# Altium schematic sheet Control.SchDoc
size A4
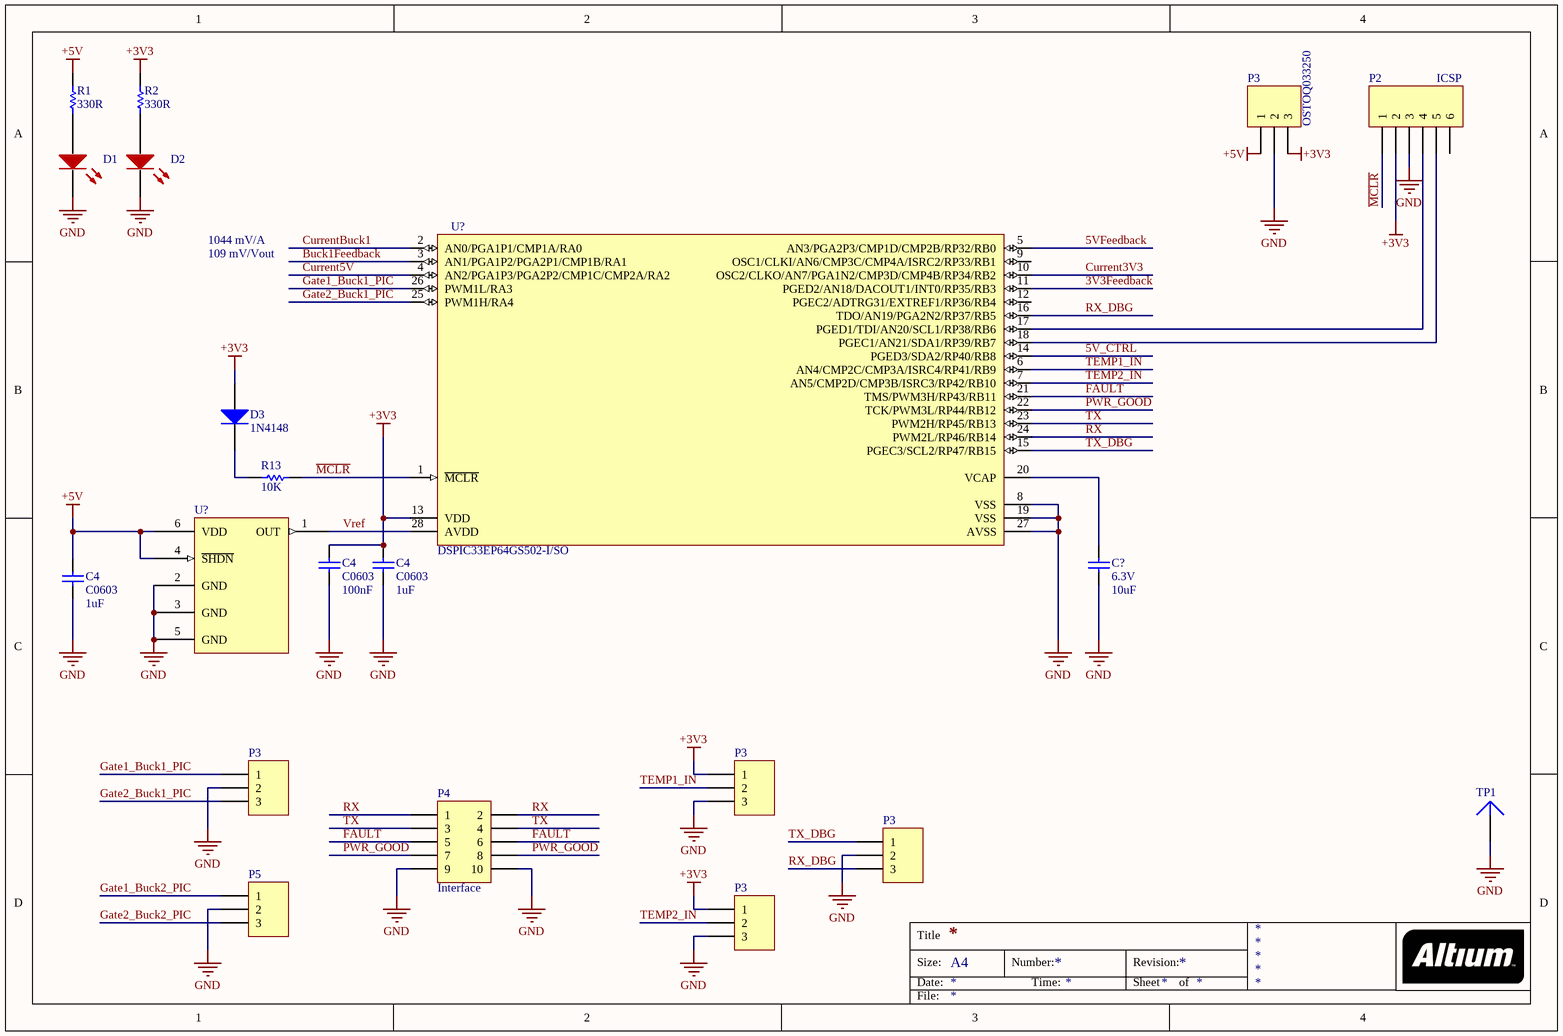
[diagram p0: Control.SchDoc]

## Parts
(Parts that share a designator on the sheet are numbered #1, #2 ... from top to bottom, then left to right.)
C4#1  C0603  value 100nF  [0603]
C4#2  C0603  value 1uF  [0603]
C4#3  C0603  value 1uF  [0603]
C?  6.3V  value 10uF  [C0805]
D1  15-21SURC/S530-A3/TR8  [15-21SURC/S530-A3/TR8]  (value not drawn)
D2  15-21SURC/S530-A3/TR8  [15-21SURC/S530-A3/TR8]  (value not drawn)
D3  1N4148  [SOD80C]
P2  ICSP  [My_1X06]
P3#1  XY2500R-F 3P  [OSTOQ033250]  (value not drawn)
P3#2  Header 3  [My_1X03]  (value not drawn)
P3#3  Header 3  [My_1X03]  (value not drawn)
P3#4  Header 3  [My_1X03]  (value not drawn)
P3#5  Header 3  [My_1X03]  (value not drawn)
P4  Interface  [HDR2X5]
P5  Header 3  [My_1X03]  (value not drawn)
R1  value 330R  [8RB-1206]  (hidden comment: SMD)
R2  value 330R  [8RB-1206]  (hidden comment: SMD)
R13  10K  [ERA-0603]
TP1  (no value)  [PIN1]
U?#1  Manufacturer Part Number: DSPIC33EP64GS502-I/SO  [MCHP-SOIC-SO28_N]  (hidden comment: DSPIC33EP64GS502)
U?#2  MCP1501T  [SOT-23-6]  (value not drawn)

## Nets
+3V3: C4#1.1 C4#2.1 D3.1(A) P2.2 P3#1.3 P3#3.1 P3#5.1 R2.1 U?#1.13(VDD)
+5V: C4#3.1 P3#1.1 R1.1 U?#2.4(~{SHDN}) U?#2.6(VDD)
GND: C4#1.2 C4#2.2 C4#3.2 C?.1 D1.2 D2.2 P2.3 P3#1.2 P3#2.2 P3#3.3 P3#4.2 P3#5.3 P4.9 P4.10 P5.2 TP1.1 U?#1.8(VSS) U?#1.19(VSS) U?#1.27(AVSS) U?#2.2(GND) U?#2.3(GND) U?#2.5(GND)
3V3Feedback: U?#1.11(PGED2/AN18/DACOUT1/INT0/RP35/RB3)
5V_CTRL: U?#1.14(PGED3/SDA2/RP40/RB8)
5VFeedback: U?#1.5(AN3/PGA2P3/CMP1D/CMP2B/RP32/RB0)
Buck1Feedback: U?#1.3(AN1/PGA1P2/PGA2P1/CMP1B/RA1)
Current3V3: U?#1.10(OSC2/CLKO/AN7/PGA1N2/CMP3D/CMP4B/RP34/RB2)
Current5V: U?#1.4(AN2/PGA1P3/PGA2P2/CMP1C/CMP2A/RA2)
CurrentBuck1: U?#1.2(AN0/PGA1P1/CMP1A/RA0)
FAULT: P4.5 P4.6 U?#1.21(TMS/PWM3H/RP43/RB11)
Gate1_Buck1_PIC: P3#2.1 U?#1.26(PWM1L/RA3)
Gate1_Buck2_PIC: P5.1
Gate2_Buck1_PIC: P3#2.3 U?#1.25(PWM1H/RA4)
Gate2_Buck2_PIC: P5.3
~{MCLR}: P2.1 R13.1 U?#1.1(~{MCLR})
PWR_GOOD: P4.7 P4.8 U?#1.22(TCK/PWM3L/RP44/RB12)
RX: P4.1 P4.2 U?#1.24(PWM2L/RP46/RB14)
RX_DBG: P3#4.3 U?#1.16(TDO/AN19/PGA2N2/RP37/RB5)
TEMP1_IN: P3#3.2 U?#1.6(AN4/CMP2C/CMP3A/ISRC4/RP41/RB9)
TEMP2_IN: P3#5.2 U?#1.7(AN5/CMP2D/CMP3B/ISRC3/RP42/RB10)
TX: P4.3 P4.4 U?#1.23(PWM2H/RP45/RB13)
TX_DBG: P3#4.1 U?#1.15(PGEC3/SCL2/RP47/RB15)
Vref: U?#1.28(AVDD) U?#2.1(OUT)
NetC?_2: C?.2 U?#1.20(VCAP)
NetD1_1: D1.1 R1.2
NetD2_1: D2.1 R2.2
NetD3_2: D3.2(K) R13.2
NetP2_4: P2.4 U?#1.17(PGED1/TDI/AN20/SCL1/RP38/RB6)
NetP2_5: P2.5 U?#1.18(PGEC1/AN21/SDA1/RP39/RB7)

Not connected (* = marked no-connect by the designer): P2 6; U?#1 9(OSC1/CLKI/AN6/CMP3C/CMP4A/ISRC2/RP33/RB1) 12(PGEC2/ADTRG31/EXTREF1/RP36/RB4)

## Notes on the sheet
- 1044 mV/A
- 109 mV/Vout
- Title
- Size:
- Date:
- A4
- Number:
- Time:
- Revision:
- Sheet
- of
- File:

## Library data of the parts
C4#1-C4#3 = C0603: C1608X7R1C105K X7R; Note: Footprint corresponds to dimensions for bulk cassette packaging. This case size has tightened tolerances.; Published: 17-Jul-2002; LatestRevisionDate: 19-Mar-2004; LatestRevisionNote: Silkscreen size reduced.; DatasheetDocument: Mar-2001; PackageDocument: Mar-2001; PackageReference: 0603; Publisher: Altium Limited; Code_JEITA: 0603; Code_IPC: 1608 [0603]; ComponentLink1Description: Manufacturer Link; ComponentLink1URL: http://www.kemet.com/; ComponentLink2Description: Datasheet; ComponentLink2URL: http://www.kemet.com/kemet/web/homepage/kechome.nsf/vapubfilesname/F3102TA.pdf/$file/F3102TA.pdf
C? = CDR01: Ceramic Chip Capacitor - MIL-PRF-55681; Published: 17-Jul-2002; LatestRevisionDate: 19-Mar-2004; LatestRevisionNote: Silkscreen size reduced.; DatasheetDocument: Mar-2001; PackageDocument: Mar-2001; PackageReference: C0805; Publisher: Altium Limited; Code_JEITA: 0805; Code_IPC: 2012[0805]; ComponentLink1Description: Manufacturer Link; ComponentLink1URL: http://www.kemet.com/; ComponentLink2Description: Datasheet; ComponentLink2URL: http://www.kemet.com/kemet/web/homepage/kechome.nsf/vapubfilesname/F3102TA.pdf/$file/F3102TA.pdf
D1 D2 = 15-21SURC/S530-A3/TR8 led smd 0805 red
D3 = 1N4148: High Conductance Fast Diode; Published: 8-Jun-2000; LatestRevisionDate: 17-Jul-2002; LatestRevisionNote: Re-released for DXP Platform.; DatasheetDocument: 1997; PackageReference: DO-35; Publisher: Altium Limited; Code_JEDEC: DO-204-AH; ComponentLink1Description: Manufacturer Link; ComponentLink1URL: http://www.fairchildsemi.com/; ComponentLink2Description: Datasheet; ComponentLink2URL: http://www.fairchildsemi.com/ds/1N%2F1N4148.pdf
P2 = Header 6: Header, 6-Pin; LatestRevisionDate: 17-Jul-2002; LatestRevisionNote: Re-released for DXP Platform.; Publisher: Altium Limited
P3#1 = XY2500R-F 3P: HEADER 3P P/CI 90gra VERDE P=3.81MM XY2500R-F; Manufacturer: On Shore Technology Inc.; Material Flammability Rating: UL94 V-0; Voltage - UL: 300V; Current - UL: 10A; Pitch: 0.150" (3.81mm); Number of Levels: 1; Positions Per Level: 3; Header Orientation: Vertical; Contact Tail Length: 0.138" (3.50mm); Supplier 1: Digi-Key; Manufacturer Part Number: OSTOQ033250; Wire Strip Length: -; Termination Style: Solder; Mounting Type: Through Hole; Supplier: Digi-Key; Category: Connectors, Interconnects; Supplier Part Number: ED2820-ND; Voltage - IEC: -; Operating Temperature: -30°C ~ 105°C; Color: Green; Features: -; Ingress Protection: -; Wire Gauge or Range - mm²: -; Insulation Height: 0.362" (9.20mm); Wire Gauge or Range - AWG: -; Plug Wire Entry: -; Screw Size: -; Contact Mating Finish: Tin; Torque - Screw: -; Housing Material: Thermoplastic; Current - IEC: -; Contact Material: Brass; RoHS: RoHS Compliant; Part Status: Active; Packaging: Bulk; Type: Header, Male Pins, Shrouded (4 Side); Number of Positions: 3
P3#2-P3#5 P5 = Header 3: Header, 3-Pin; LatestRevisionDate: 17-Jul-2002; LatestRevisionNote: Re-released for DXP Platform.; Publisher: Altium Limited
P4 = Header 5X2: Header, 5-Pin, Dual row; LatestRevisionDate: 17-Jul-2002; LatestRevisionNote: Re-released for DXP Platform.; Publisher: Altium Limited
R1 R2 = ERJ8BQ: Low Ohmic Value Thick Film Chip Resistor, 0.22 Ohm to 9.1 Ohm Range, 1%, 2% and 5% Tolerance, 1206 Size, 0.33 W; Published: 17-Dec-2003; LatestRevisionDate: 19-Mar-2004; LatestRevisionNote: Silkscreen size reduced.; PackageDocument: Mar-2003; PackageReference: 8RB-1206; Publisher: Altium Limited; Code_IPC: 3216 [1206]; ComponentLink1Description: Manufacturer Link; ComponentLink1URL: http://www.panasonic.com/industrial/components/resistive_products.htm; ComponentLink2Description: Datasheet; ComponentLink2URL: http://www.panasonic.com/industrial/components/pdf/AOA0000CE3.pdf
R13 = ERA3Y: Rectangular Thick Film Chip Resistor, 10 Ohm to 330k Ohm Range, 0.1% and 0.5% Tolerance, 0603 Size, 0.063 W; Note: If flow soldering, adjust pad width of PCB Footprint to 0.7 - 0.8 times the width of the resistor.; Published: 17-Dec-2003; LatestRevisionDate: 19-Mar-2004; LatestRevisionNote: Silkscreen size reduced.; PackageDocument: Mar-2003; PackageReference: ERA-0603; Publisher: Altium Limited; Code_IPC: 1608 [0603]; ComponentLink1Description: Manufacturer Link; ComponentLink1URL: http://www.panasonic.com/industrial/components/resistive_products.htm; ComponentLink2Description: Datasheet; ComponentLink2URL: http://www.panasonic.com/industrial/components/pdf/AOA0000CE8.pdf
TP1 = Plug: LatestRevisionDate: 17-Jul-2002; LatestRevisionNote: Re-released for DXP Platform.; Publisher: Altium Limited
U?#1 = DSPIC33EP64GS502: dsPIC dsPIC™ 33EP Microcontroller IC 16-Bit 70 MIPs 64KB (64K x 8) FLASH 28-SOIC; Manufacturer: Microchip Technology; Number of I/O: 21; Peripherals: Brown-out Detect/Reset, POR, PWM, WDT; Oscillator Type: Internal; Speed: 70 MIPs; Voltage - Supply (Vcc/Vdd): 3 V ~ 3.6 V; Data Converters: A/D 12x12b, D/A 1x12b; Connectivity: I²C, IrDA, LIN, SPI, UART/USART; RAM Size: 8K x 8; Package / Case: 28-SOIC (0.295", 7.50mm Width); Supplier Device Package: 28-SOIC; Program Memory Size: 64KB (64K x 8); Operating Temperature: -40°C ~ 85°C (TA); Core Processor: dsPIC; Category: Integrated Circuits (ICs); Program Memory Type: FLASH; Core Size: 16-Bit; Packaging: Tube; EEPROM Size: -; RoHS: RoHS Compliant; Part Status: Active; Supplier: Digi-Key; Supplier Part Number: DSPIC33EP64GS502-I/SO-ND
U?#2 = MCP1501T: Series Voltage Reference IC ±0.08% 20mA SOT-23-6